# EAGLE schematic Amplifer (EAGLE 7.1.0)
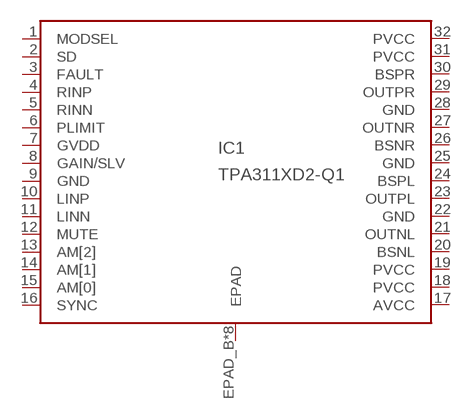
[diagram p0: schematic, sheet 1]

## Parts
IC1  TPA311XD2-Q1  [HTSSOP-32]
Unconnected: IC1.1(MODSEL) IC1.2(SD) IC1.3(FAULT) IC1.4(RINP) IC1.5(RINN) IC1.6(PLIMIT) IC1.7(GVDD) IC1.8(GAIN/SLV) IC1.10(LINP) IC1.11(LINN) IC1.12(MUTE) IC1.13(AM[2]) IC1.14(AM[1]) IC1.15(AM[0]) IC1.16(SYNC) IC1.20(BSNL) IC1.21(OUTNL) IC1.23(OUTPL) IC1.24(BSPL) IC1.26(BSNR) IC1.27(OUTNR) IC1.29(OUTPR) IC1.30(BSPR)

## Power pins joined to a net without a drawn wire
AVCC: IC1.17(AVCC)
EPAD: IC1.EPAD_B(EPAD) IC1.EPAD_T(EPAD) IC1.EPAD_VIA1(EPAD) IC1.EPAD_VIA2(EPAD) IC1.EPAD_VIA3(EPAD) IC1.EPAD_VIA4(EPAD) IC1.EPAD_VIA5(EPAD) IC1.EPAD_VIA6(EPAD)
GND: IC1.9(GND) IC1.22(GND) IC1.25(GND) IC1.28(GND)
PVCC: IC1.18(PVCC) IC1.19(PVCC) IC1.31(PVCC) IC1.32(PVCC)

## Library data of the parts
IC1 = My_TI:TPA311XD2-Q1: TPA311xD2-Q1 100-W and 50-W Class-D Stereo Automotive Amplifiers Wide Voltage Range: 4.5V to 26V Datasheet <http://www.ti.com/lit/ds/symlink/tpa3116d2-q1.pdf>